# EAGLE design tangnano9k-board (EAGLE 9.0.1)
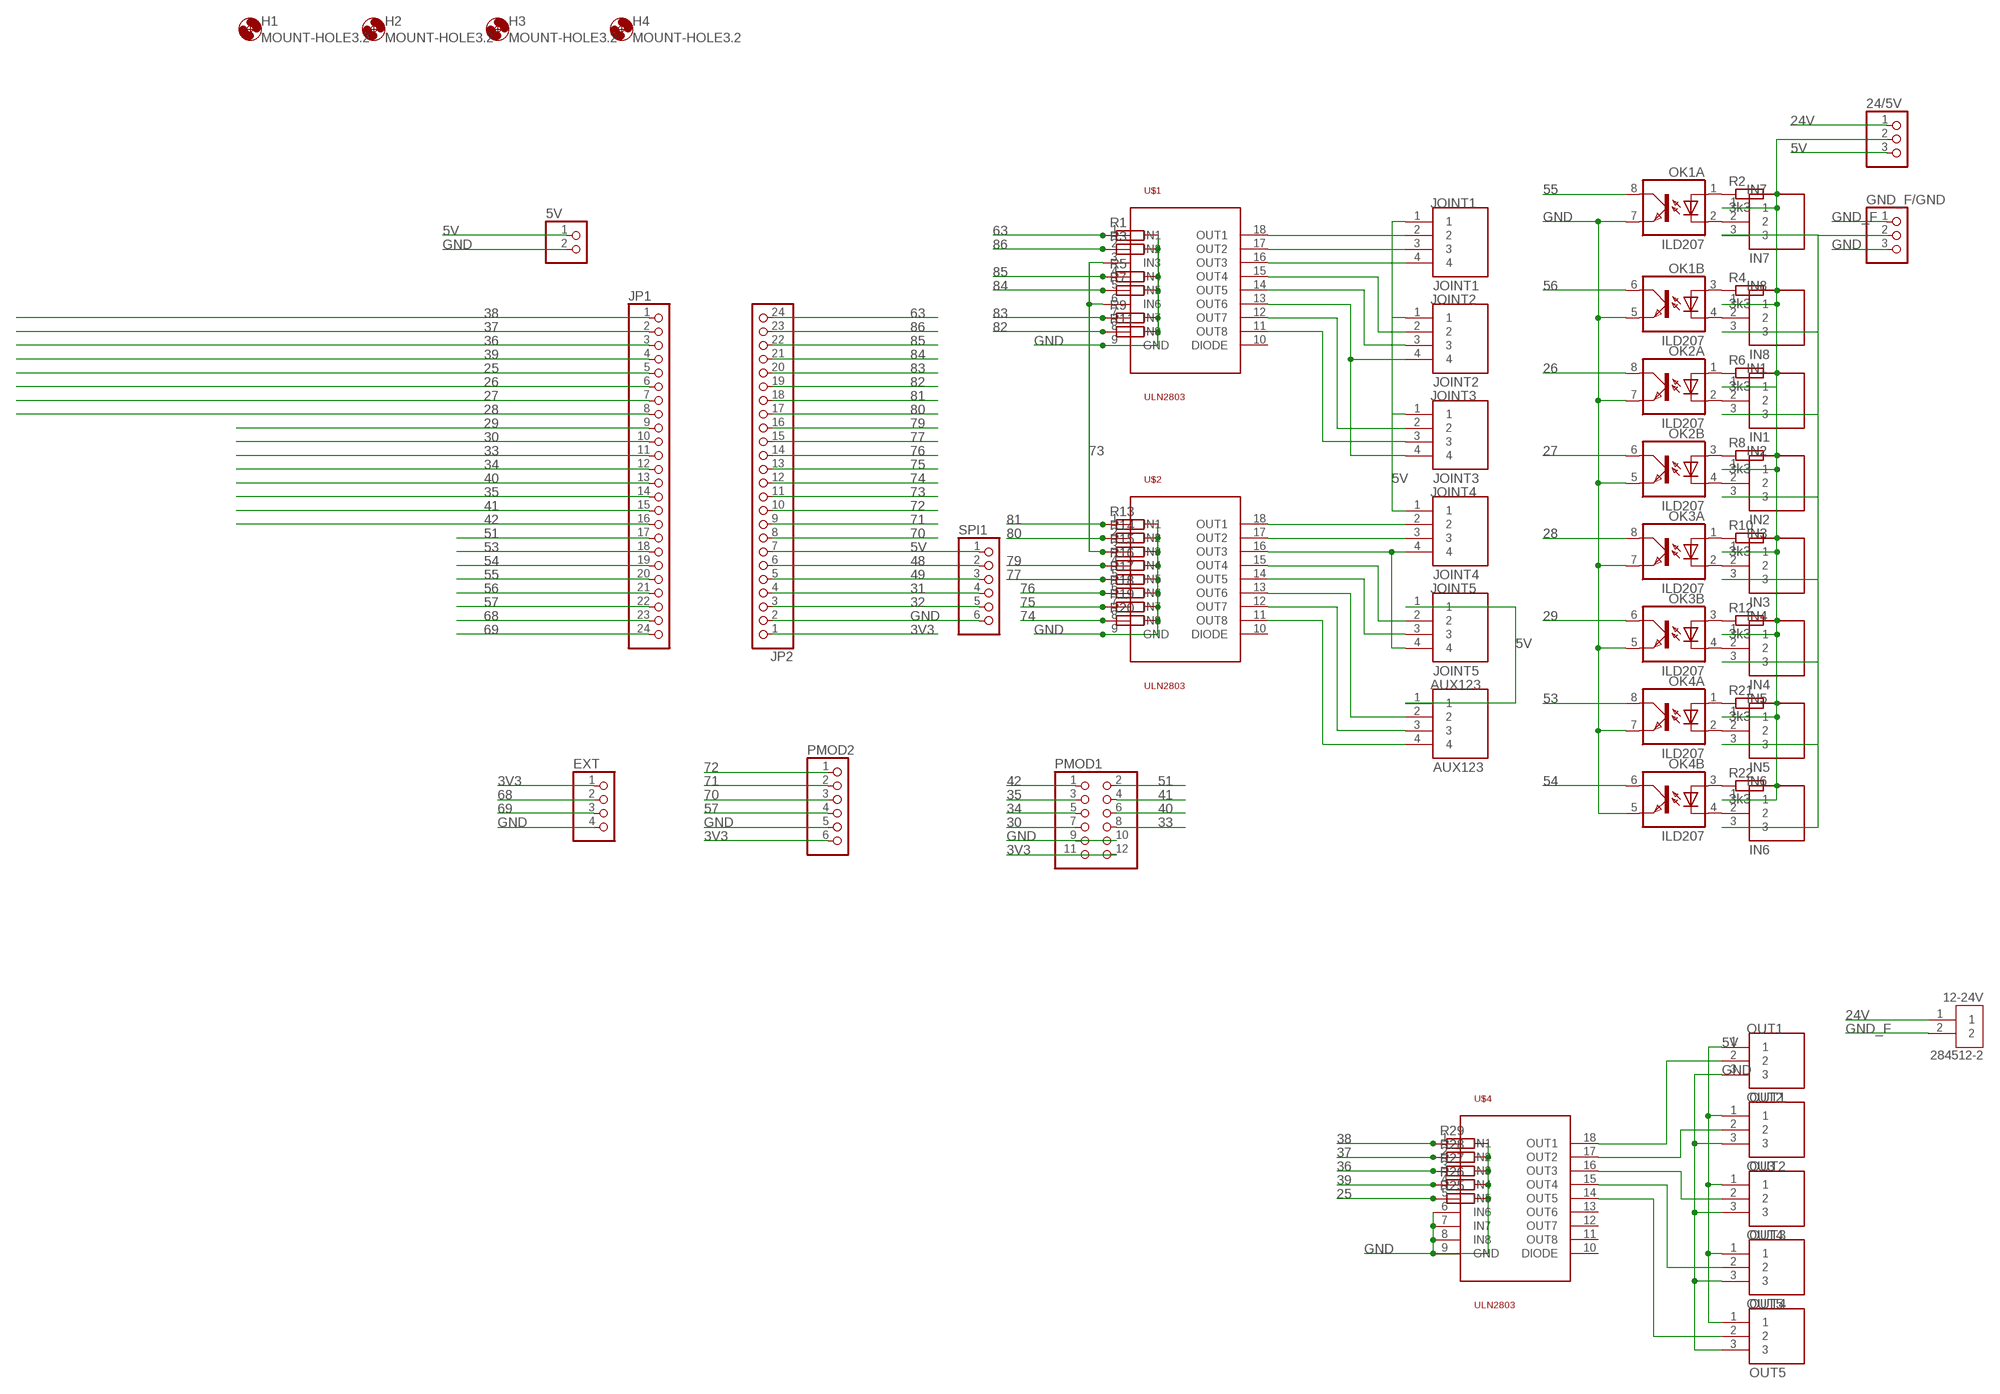
[diagram p0: schematic, sheet 1]

## Parts
5V  PINHD-1X2  [1X02]
12-24V  284512-2  [TE_284512-2]
24/5V  PINHD-1X3  [1X03]
AUX123  AUX123  284512-4  [TE_284512-4]
EXT  PINHD-1X4  [1X04]
GND_F/GND  PINHD-1X3  [1X03]
H1  MOUNT-HOLE3.2  [3,2]
H2  MOUNT-HOLE3.2  [3,2]
H3  MOUNT-HOLE3.2  [3,2]
H4  MOUNT-HOLE3.2  [3,2]
IN1  IN1  284512-3  [TE_284512-3]
IN2  IN2  284512-3  [TE_284512-3]
IN3  IN3  284512-3  [TE_284512-3]
IN4  IN4  284512-3  [TE_284512-3]
IN5  IN5  284512-3  [TE_284512-3]
IN6  IN6  284512-3  [TE_284512-3]
IN7  IN7  284512-3  [TE_284512-3]
IN8  IN8  284512-3  [TE_284512-3]
JOINT1  JOINT1  284512-4  [TE_284512-4]
JOINT2  JOINT2  284512-4  [TE_284512-4]
JOINT3  JOINT3  284512-4  [TE_284512-4]
JOINT4  JOINT4  284512-4  [TE_284512-4]
JOINT5  JOINT5  284512-4  [TE_284512-4]
JP1  PINHD-1X24  [1X24]
JP2  PINHD-1X24  [1X24]
OK1  ILD207  [SOIC08]
OK2  ILD207  [SOIC08]
OK3  ILD207  [SOIC08]
OK4  ILD207  [SOIC08]
OU3  OUT3  284512-3  [TE_284512-3]
OUT1  OUT1  284512-3  [TE_284512-3]
OUT2  OUT2  284512-3  [TE_284512-3]
OUT4  OUT4  284512-3  [TE_284512-3]
OUT5  OUT5  284512-3  [TE_284512-3]
PMOD1  PINHD-2X6  [2X06]
PMOD2  PINHD-1X6  [1X06]
R1  R-EU_M0805  [M0805]
R2  3k3  R-EU_M0805  [M0805]
R3  R-EU_M0805  [M0805]
R4  3k3  R-EU_M0805  [M0805]
R5  R-EU_M0805  [M0805]
R6  3k3  R-EU_M0805  [M0805]
R7  R-EU_M0805  [M0805]
R8  3k3  R-EU_M0805  [M0805]
R9  R-EU_M0805  [M0805]
R10  3k3  R-EU_M0805  [M0805]
R11  R-EU_M0805  [M0805]
R12  3k3  R-EU_M0805  [M0805]
R13  R-EU_M0805  [M0805]
R14  R-EU_M0805  [M0805]
R15  R-EU_M0805  [M0805]
R16  R-EU_M0805  [M0805]
R17  R-EU_M0805  [M0805]
R18  R-EU_M0805  [M0805]
R19  R-EU_M0805  [M0805]
R20  R-EU_M0805  [M0805]
R21  3k3  R-EU_M0805  [M0805]
R22  3k3  R-EU_M0805  [M0805]
R25  R-EU_M0805  [M0805]
R26  R-EU_M0805  [M0805]
R27  R-EU_M0805  [M0805]
R28  R-EU_M0805  [M0805]
R29  R-EU_M0805  [M0805]
SPI1  PINHD-1X6  [1X06]
U$1  ULN2803  [SO18L]
U$2  ULN2803  [SO18L]
U$4  ULN2803  [SO18L]

## Nets
3V3: EXT.1 JP2.1 PMOD1.11 PMOD1.12 PMOD2.6
5V: 5V.1 24/5V.3 AUX123.1 JOINT1.1 JOINT2.1 JOINT3.1 JOINT4.1 JOINT5.1 JP2.7 OU3.1 OUT1.1 OUT2.1 OUT4.1 OUT5.1 SPI1.1
24V: 12-24V.1 24/5V.1
25: JP1.5 R25.1 U$4.5(IN5)
26: JP1.6 OK2.8(A:COL)
27: JP1.7 OK2.6(B:COL)
28: JP1.8 OK3.8(A:COL)
29: JP1.9 OK3.6(B:COL)
30: JP1.10 PMOD1.7
31: JP2.4 SPI1.4
32: JP2.3 SPI1.5
33: JP1.11 PMOD1.8
34: JP1.12 PMOD1.5
35: JP1.14 PMOD1.3
36: JP1.3 R27.1 U$4.3(IN3)
37: JP1.2 R28.1 U$4.2(IN2)
38: JP1.1 R29.1 U$4.1(IN1)
39: JP1.4 R26.1 U$4.4(IN4)
40: JP1.13 PMOD1.6
41: JP1.15 PMOD1.4
42: JP1.16 PMOD1.1
48: JP2.6 SPI1.2
49: JP2.5 SPI1.3
51: JP1.17 PMOD1.2
53: JP1.18 OK4.8(A:COL)
54: JP1.19 OK4.6(B:COL)
55: JP1.20 OK1.8(A:COL)
56: JP1.21 OK1.6(B:COL)
57: JP1.22 PMOD2.4
63: JP2.24 R1.1 U$1.1(IN1)
68: EXT.2 JP1.23
69: EXT.3 JP1.24
70: JP2.8 PMOD2.3
71: JP2.9 PMOD2.2
72: JP2.10 PMOD2.1
73: JP2.11 R15.1 U$1.3(IN3) U$1.6(IN6) U$2.3(IN3)
74: JP2.12 R20.1 U$2.8(IN8)
75: JP2.13 R19.1 U$2.7(IN7)
76: JP2.14 R18.1 U$2.6(IN6)
77: JP2.15 R17.1 U$2.5(IN5)
79: JP2.16 R16.1 U$2.4(IN4)
80: JP2.17 R14.1 U$2.2(IN2)
81: JP2.18 R13.1 U$2.1(IN1)
82: JP2.19 R11.1 U$1.8(IN8)
83: JP2.20 R9.1 U$1.7(IN7)
84: JP2.21 R7.1 U$1.5(IN5)
85: JP2.22 R5.1 U$1.4(IN4)
86: JP2.23 R3.1 U$1.2(IN2)
GND: 5V.2 EXT.4 GND_F/GND.3 JP2.2 OK1.5(B:EMIT) OK1.7(A:EMIT) OK2.5(B:EMIT) OK2.7(A:EMIT) OK3.5(B:EMIT) OK3.7(A:EMIT) OK4.5(B:EMIT) OK4.7(A:EMIT) OU3.3 OUT1.3 OUT2.3 OUT4.3 OUT5.3 PMOD1.9 PMOD1.10 PMOD2.5 R1.2 R3.2 R5.2 R7.2 R9.2 R11.2 R13.2 R14.2 R15.2 R16.2 R17.2 R18.2 R19.2 R20.2 R25.2 R26.2 R27.2 R28.2 R29.2 SPI1.6 U$1.9(GND) U$2.9(GND) U$4.6(IN6) U$4.7(IN7) U$4.8(IN8) U$4.9(GND)
GND_F: 12-24V.2 GND_F/GND.1
N$1: JOINT1.4 U$1.16(OUT3)
N$2: JOINT1.3 U$1.17(OUT2)
N$3: JOINT1.2 U$1.18(OUT1)
N$4: JOINT2.2 U$1.15(OUT4)
N$5: JOINT2.3 U$1.14(OUT5)
N$6: JOINT2.4 JOINT3.4 U$1.13(OUT6)
N$7: JOINT3.2 U$1.12(OUT7)
N$8: JOINT3.3 U$1.11(OUT8)
N$9: JOINT4.2 U$2.18(OUT1)
N$10: JOINT4.3 U$2.17(OUT2)
N$11: JOINT4.4 JOINT5.4 U$2.16(OUT3)
N$12: JOINT5.2 U$2.15(OUT4)
N$13: JOINT5.3 U$2.14(OUT5)
N$14: AUX123.2 U$2.13(OUT6)
N$15: AUX123.3 U$2.12(OUT7)
N$16: AUX123.4 U$2.11(OUT8)
N$17: IN7.2 OK1.2(A:C)
N$18: IN8.2 OK1.4(B:C)
N$19: IN1.2 OK2.2(A:C)
N$20: IN2.2 OK2.4(B:C)
N$21: IN3.2 OK3.2(A:C)
N$22: IN4.2 OK3.4(B:C)
N$23: IN5.2 OK4.2(A:C)
N$24: IN6.2 OK4.4(B:C)
N$27: OK1.1(A:A) R2.1
N$28: OK1.3(B:A) R4.1
N$29: OK2.1(A:A) R6.1
N$30: OK2.3(B:A) R8.1
N$31: OK3.1(A:A) R10.1
N$32: OK3.3(B:A) R12.1
N$33: OK4.1(A:A) R21.1
N$34: OK4.3(B:A) R22.1
N$37: OUT2.2 U$4.17(OUT2)
N$38: OU3.2 U$4.16(OUT3)
N$39: OUT4.2 U$4.15(OUT4)
N$40: OUT5.2 U$4.14(OUT5)
N$41: OUT1.2 U$4.18(OUT1)
N$42: 24/5V.2 IN1.1 IN2.1 IN3.1 IN4.1 IN5.1 IN6.1 IN7.1 IN8.1 R2.2 R4.2 R6.2 R8.2 R10.2 R12.2 R21.2 R22.2
N$44: GND_F/GND.2 IN1.3 IN2.3 IN3.3 IN4.3 IN5.3 IN6.3 IN7.3 IN8.3
Unconnected: U$1.10(DIODE) U$2.10(DIODE) U$4.10(DIODE) U$4.11(OUT8) U$4.12(OUT7) U$4.13(OUT6)

## Library data of the parts
5V = pinhead:PINHD-1X2: PIN HEADER
12-24V = 284512-2:284512-2: Terminal Block Header, 2, 300 V, 11 A, 3.5 Mm, Through Hole Right Angle, Header Check availability <https://pricing.snapeda.com/parts/284512-2/TE%20Connectivity/view-part?ref=eda>; AVAILABILITY: In Stock; COMMENT: 284512-2; DESCRIPTION: 2 Position Terminal Block Header, Male Pins, Shrouded (4 Side) 0.138 (3.50mm) 90°, Right Angle Through Hole; EU_ROHS_COMPLIANCE: Compliant; MF: TE Connectivity; MP: 284512-2; PACKAGE: None; PRICE: None; PURCHASE-URL: https://pricing.snapeda.com/search?q=284512-2&ref=eda
24/5V GND_F/GND = pinhead:PINHD-1X3: PIN HEADER
AUX123 JOINT1-JOINT5 = 284512-4:284512-4: Check availability <https://pricing.snapeda.com/parts/284512-4/TE%20Connectivity/view-part?ref=eda>; AVAILABILITY: In Stock; CENTERLINE_PITCH: 3.5 mm[.138 in]; COMMENT: 284512-4; DESCRIPTION: 4 POS TERMI-BLOK HDR 900 POLAR; EU_ROHS_COMPLIANCE: Compliant; MF: TE Connectivity; MP: 284512-4; NUMBER_OF_POSITIONS: 4; PACKAGE: None; PRICE: None; PURCHASE-URL: https://pricing.snapeda.com/search/part/284512-4/?ref=eda
EXT = pinhead:PINHD-1X4: PIN HEADER
H1-H4 = holes:MOUNT-HOLE: MOUNTING HOLE with drill center marker
IN1-IN8 OU3 OUT1 OUT2 OUT4 OUT5 = 284512-3:284512-3: Check availability <https://pricing.snapeda.com/parts/284512-3/TE%20Connectivity/view-part?ref=eda>; AVAILABILITY: In Stock; CENTERLINE_PITCH: 3.5 mm[.138 in]; COMMENT: 284512-3; DESCRIPTION: Pluggable terminal block; socket; male; angled; 3.5mm;; EU_ROHS_COMPLIANCE: Compliant; MF: TE Connectivity; MP: 284512-3; NUMBER_OF_POSITIONS: 3; PACKAGE: None; PRICE: None; PURCHASE-URL: https://pricing.snapeda.com/search/part/284512-3/?ref=eda
JP1 JP2 = pinhead:PINHD-1X24: PIN HEADER
OK1-OK4 = optocoupler:ILD2*: Siemens ILD205/206/207/211/213/217 DUAL PHOTOTRANSISTOR SMALL OUTLINE SURFACE MOUNT OPTOCOUPLER Source: 153385-da-01-en-Optocoupler_ILD205-T.pdf; MF: VISHAY/TELEFUNKEN; MPN: ILD207T; OC_FARNELL: 1469603; OC_NEWARK: 97C8648
PMOD1 = pinhead:PINHD-2X6: PIN HEADER
PMOD2 SPI1 = pinhead:PINHD-1X6: PIN HEADER
R1-R22 R25-R29 = rcl:R-EU_: RESISTOR, European symbol; SPICEPREFIX: R
U$1 U$2 U$4 = uln2803:ULN2803

## Board
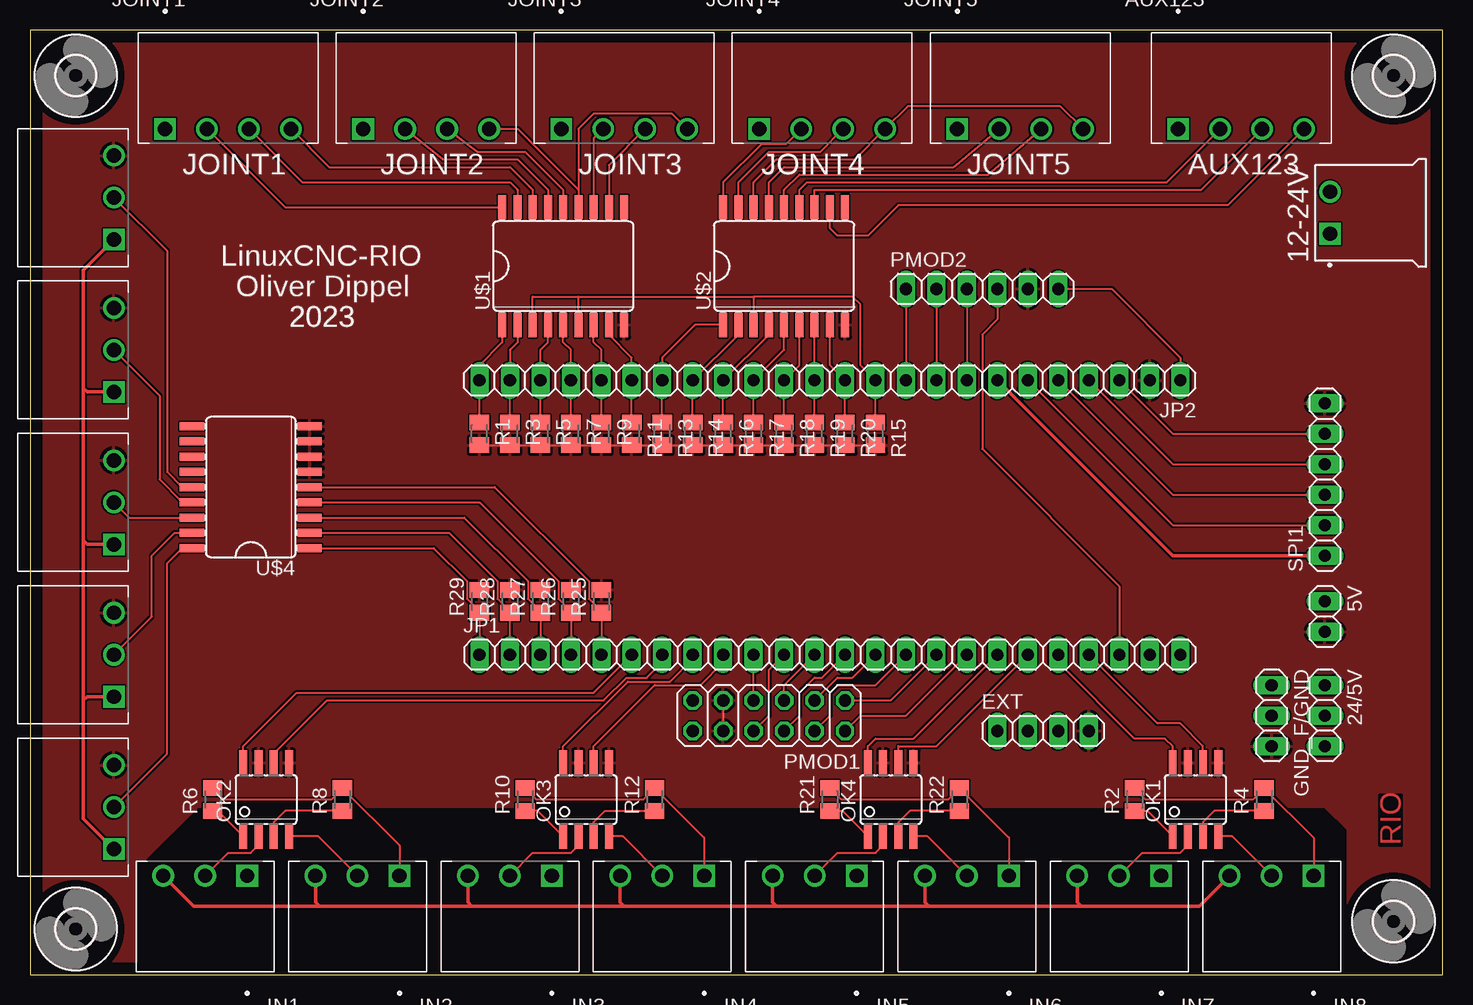
[diagram p1: board, top side]
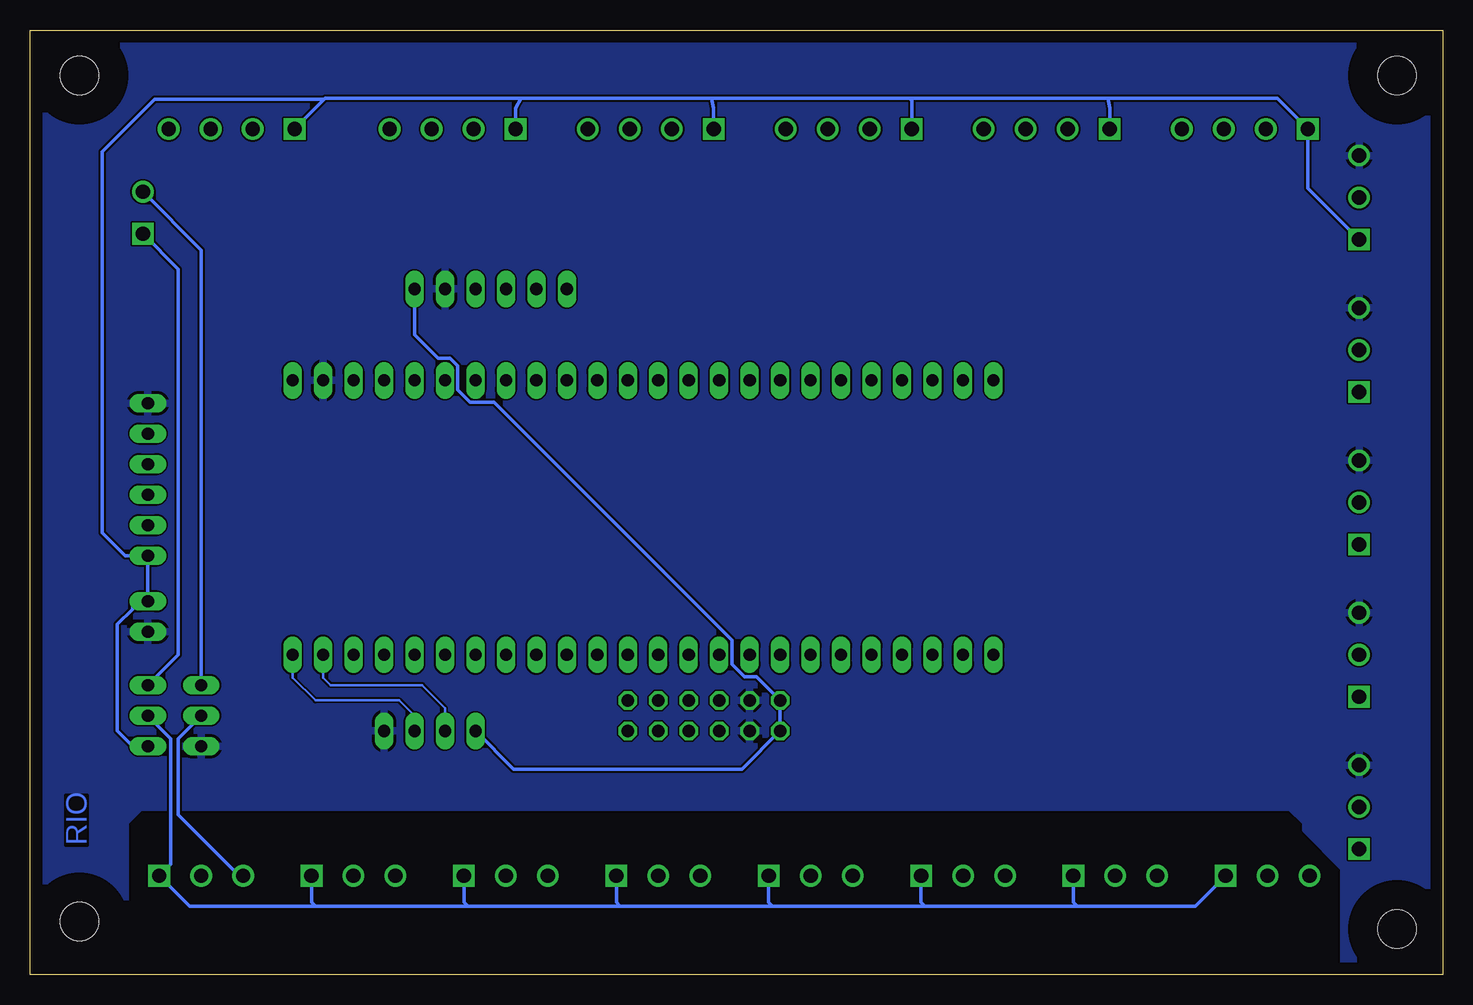
[diagram p2: board, bottom side, seen from below]

Size 117.78 x 78.73 mm. Coordinates in mm from the lower left corner, seen from the top.
Outline: 0,0 117.78,0 117.78,78.73 0,78.73 0,0
Copper layers (1*16): Top 0.035mm / dielectric 1.5mm / Bottom 0.035mm
Design rules "default": minimum track width 6mil, minimum drill 0.35mm, track to track 6mil, track to pad 6mil, pad to pad 6mil, via to via 6mil, smd to smd 6mil, copper to edge 40mil, drill to drill 6mil, minimum pad ring 10mil, minimum via ring 8mil, stop-mask expansion 4mil, vias tented up to drill 0mil, thermal gap 10mil

### Footprints (pad centres in the part's own frame; a part is rotated, then mirrored left to right if it is on the bottom)
1X02 = drill 1.016 long: 1 -1.27,0; 2 1.27,0
TE_284512-2 = drill 1.2 square: 1 -1.75,3.4 | drill 1.2: 2 1.75,3.4
1X03 = drill 1.016 long: 1 -2.54,0; 2 0,0; 3 2.54,0
TE_284512-4 = drill 1.2 square: 1 -5.25,0 | drill 1.2: 2 -1.75,0; 3 1.75,0; 4 5.25,0
1X04 = drill 1.016 long: 1 -3.81,0; 2 -1.27,0; 3 1.27,0; 4 3.81,0
3,2 = hole 3.2: 0,0
TE_284512-3 = drill 1.2 square: 1 -3.5,0 | drill 1.2: 2 0,0; 3 3.5,0
1X24 = drill 1.016 long: 1 -29.21,0; 2 -26.67,0; 3 -24.13,0; 4 -21.59,0; 5 -19.05,0; 6 -16.51,0; 7 -13.97,0; 8 -11.43,0; 9 -8.89,0; 10 -6.35,0; 11 -3.81,0; 12 -1.27,0; 13 1.27,0; 14 3.81,0; 15 6.35,0; 16 8.89,0; 17 11.43,0; 18 13.97,0; 19 16.51,0; 20 19.05,0; 21 21.59,0; 22 24.13,0; 23 26.67,0; 24 29.21,0
SOIC08 = smd 0.66 x 2.032: 1 -1.905,-3.073; 2 -0.635,-3.073; 3 0.635,-3.073; 4 1.905,-3.073; 5 1.905,3.073; 6 0.635,3.073; 7 -0.635,3.073; 8 -1.905,3.073
2X06 = drill 1.016 octagon: 1 -6.35,-1.27; 2 -6.35,1.27; 3 -3.81,-1.27; 4 -3.81,1.27; 5 -1.27,-1.27; 6 -1.27,1.27; 7 1.27,-1.27; 8 1.27,1.27; 9 3.81,-1.27; 10 3.81,1.27; 11 6.35,-1.27; 12 6.35,1.27
1X06 = drill 1.016 long: 1 -6.35,0; 2 -3.81,0; 3 -1.27,0; 4 1.27,0; 5 3.81,0; 6 6.35,0
M0805 = smd 1.3 x 1.6: 1 -0.95,0; 2 0.95,0
SO18L = smd 0.66 x 2.032: 1 -5.08,-4.902; 2 -3.81,-4.902; 3 -2.54,-4.902; 4 -1.27,-4.902; 5 0,-4.902; 6 1.27,-4.902; 7 2.54,-4.902; 8 3.81,-4.902; 9 5.08,-4.902; 10 5.08,4.902; 11 3.81,4.902; 12 2.54,4.902; 13 1.27,4.902; 14 0,4.902; 15 -1.27,4.902; 16 -2.54,4.902; 17 -3.81,4.902; 18 -5.08,4.902

### Placement (x,y rotation side)
5V  107.95,29.85 270 top
12-24V  111.76,63.5 90 top
24/5V  107.95,21.59 270 top
AUX123  100.97,70.48 0 top
EXT  84.45,20.32 0 top
GND_F/GND  103.51,21.59 270 top
H1  3.81,74.93 0 top
H2  113.67,74.93 0 top
H3  3.81,3.81 0 top
H4  113.67,4.45 0 top
IN1  14.6,8.25 180 top
IN2  27.3,8.25 180 top
IN3  40,8.25 180 top
IN4  52.7,8.25 180 top
IN5  65.41,8.25 180 top
IN6  78.11,8.25 180 top
IN7  90.81,8.25 180 top
IN8  103.51,8.25 180 top
JOINT1  16.51,70.48 0 top
JOINT2  33.02,70.48 0 top
JOINT3  49.53,70.48 0 top
JOINT4  66.04,70.48 0 top
JOINT5  82.55,70.48 0 top
JP1  66.68,26.67 0 top
JP2  66.68,49.53 180 top
OK1  97.16,14.6 0 top
OK2  19.69,14.6 0 top
OK3  46.35,14.6 0 top
OK4  71.76,14.6 0 top
OU3  6.98,39.37 90 top
OUT1  6.98,13.97 90 top
OUT2  6.98,26.67 90 top
OUT4  6.98,52.07 90 top
OUT5  6.98,64.77 90 top
PMOD1  61.59,21.59 180 top
PMOD2  79.38,57.15 0 top
R1  37.46,45.09 270 top
R2  92.08,14.6 90 top
R3  40,45.09 270 top
R4  102.87,14.6 90 top
R5  42.54,45.09 270 top
R6  15.24,14.6 90 top
R7  45.09,45.09 270 top
R8  26.03,14.6 90 top
R9  47.62,45.09 270 top
R10  41.27,14.6 90 top
R11  50.16,45.09 270 top
R12  52.07,14.6 90 top
R13  52.7,45.09 270 top
R14  55.24,45.09 270 top
R15  70.48,45.09 270 top
R16  57.79,45.09 270 top
R17  60.32,45.09 270 top
R18  62.87,45.09 270 top
R19  65.41,45.09 270 top
R20  67.95,45.09 270 top
R21  66.68,14.6 90 top
R22  77.47,14.6 90 top
R25  47.62,31.12 90 top
R26  45.09,31.12 90 top
R27  42.54,31.12 90 top
R28  40,31.12 90 top
R29  37.46,31.12 90 top
SPI1  107.95,41.27 90 top
U$1  44.45,59.05 0 top
U$2  62.87,59.05 0 top
U$4  18.41,40.64 90 top

### Tracks (layer width: path | path; a pad name or v marks a point on that pad's centre or on a via)
3V3
  Top 0.152: JP2.1 95.89,51.44 90.17,57.15 PMOD2.6
  Bottom 0.305: PMOD2.6 85.73,53.34 83.74,51.36 82.74,51.36 82.12,50.73 82.12,48.73 81.09,47.7 79.09,47.7 59.26,27.87 59.26,25.87 58.23,24.84 57.23,24.84 PMOD1.11 PMOD1.12 58.42,17.14 77.47,17.14 EXT.1
5V
  Top 0.305: SPI1.1 95.25,34.93 JP2.7 | OUT5.1 4.44,58.73 4.44,48.9 | OUT1.1 4.44,13.01 4.44,22.86 | 4.44,48.9 4.44,36.2 | 4.44,36.2 4.44,22.86 | OUT4.1 4.77,48.57 4.44,48.9 | OU3.1 4.77,35.87 4.44,36.2 | OUT2.1 4.75,23.17 4.44,22.86
  Bottom 0.305: AUX123.1 93.26,72.94 | 93.26,72.94 93.18,73.03 76.84,73.03 | 76.84,73.03 60.96,73.03 | 60.96,73.03 44.45,73.03 | 44.45,73.03 27.94,73.03 | 27.94,73.03 13.8,73.03 JOINT1.1 11.26,65.55 OUT5.1 | JOINT2.1 27.77,72.22 27.94,73.03 | JOINT3.1 44.28,72.86 44.45,73.03 | JOINT4.1 60.79,72.22 60.96,73.03 | JOINT5.1 77.3,72.22 76.84,73.03 | 24/5V.3 109.22,19.05 110.49,20.32 110.49,29.21 109.22,30.48 109.22,31.12 5V.1 SPI1.1 109.86,34.93 111.76,36.83 111.76,68.58 107.4,72.94 93.26,72.94
24V
  Bottom 0.305: 24/5V.1 105.41,26.67 105.41,58.8 12-24V.1
25
  Top 0.152: JP1.5 R25.1 47.62,30.29 46.6,31.32 46.6,32.78 38.73,40.64 U$4.5
26
  Top 0.152: 50.8,26.67 JP1.6 46.99,23.5 22.23,23.5 17.78,19.05 OK2.8
27
  Top 0.152: OK2.6 20.32,18.42 24.77,22.86 47.83,22.86 49.71,24.74 51.41,24.74 52.7,26.04 JP1.7
28
  Top 0.152: OK3.8 44.45,19.05 49.84,24.44 53.34,24.44 55.24,26.34 JP1.8
29
  Top 0.152: OK3.6 46.99,19.05 52.07,24.13 55.88,24.13 57.79,26.04 JP1.9
30
  Top 0.152: 60.32,26.04 JP1.10 PMOD1.7
31
  Top 0.152: JP2.4 95.25,42.55 SPI1.4
32
  Top 0.152: JP2.3 95.25,45.09 SPI1.5
33
  Top 0.152: PMOD1.8 61.59,21.59 61.59,25.4 JP1.11
34
  Top 0.152: 65.41,26.04 JP1.12 62.87,24.13 PMOD1.5
35
  Top 0.152: PMOD1.3 67.31,24.77 68.58,24.77 JP1.14
36
  Top 0.152: U$4.3 36.2,38.1 41.52,32.78 41.52,31.32 42.54,30.29 R27.1 JP1.3
37
  Top 0.152: JP1.2 40,29.85 R28.1 40,30.29 38.98,31.32 38.98,32.78 34.92,36.83 U$4.2
38
  Top 0.152: U$4.1 33.65,35.56 36.44,32.78 36.44,31.32 37.46,30.29 R29.1 JP1.1
39
  Top 0.152: JP1.4 45.09,30.29 44.99,30.39 | 44.99,30.39 44.06,31.32 44.06,32.78 37.46,39.37 U$4.4 | R26.1 44.99,30.26 44.99,30.39
40
  Top 0.152: PMOD1.6 64.14,21.59 64.14,23.5 65.41,24.77 66.04,24.77 JP1.13
41
  Top 0.152: PMOD1.4 66.68,21.59 66.68,23.5 67.31,24.13 70.48,24.13 JP1.15
42
  Top 0.152: PMOD1.1 71.76,22.86 JP1.16
48
  Top 0.152: JP2.6 95.25,37.47 SPI1.2
49
  Top 0.152: JP2.5 95.25,40.01 SPI1.3
51
  Top 0.152: PMOD1.2 69.22,21.59 73.03,21.59 JP1.17
53
  Top 0.152: OK4.8 69.85,19.05 70.48,19.69 73.66,19.69 JP1.18
54
  Top 0.152: OK4.6 72.39,19.05 75.56,19.05 JP1.19
55
  Top 0.152: OK1.8 95.25,19.05 94.62,19.69 92.08,19.69 85.73,26.04 JP1.20
56
  Top 0.152: OK1.6 97.79,19.05 95.89,20.96 93.98,20.96 JP1.21
57
  Top 0.152: PMOD2.4 80.65,54.61 79.38,53.34 79.38,43.81 90.81,32.38 JP1.22
63
  Top 0.152: R1.1 37.46,48.9 JP2.24 37.46,50.8 39.37,52.7 U$1.1
68
  Bottom 0.203: EXT.2 83.19,22.23 85.09,24.13 92.71,24.13 93.34,24.77 JP1.23
69
  Bottom 0.203: EXT.3 85.73,21.59 87,22.86 93.98,22.86 95.89,24.77 JP1.24
70
  Top 0.152: PMOD2.3 JP2.8
71
  Top 0.152: PMOD2.2 JP2.9
72
  Top 0.152: PMOD2.1 JP2.10
73
  Top 0.152: R15.1 JP2.11 69.22,50.8 69.22,55.88 68.58,56.52 60.32,56.52 | U$1.3 41.91,56.52 45.72,56.52 | 45.72,56.52 60.32,56.52 | 60.32,56.52 U$2.3 | U$1.6 45.72,56.52
74
  Top 0.152: R20.1 JP2.12 66.68,50.8 U$2.8
75
  Top 0.152: R19.1 JP2.13 U$2.7
76
  Top 0.152: R18.1 JP2.14 64.14,50.8 U$2.6
77
  Top 0.152: R17.1 JP2.15 62.87,52.07 U$2.5
79
  Top 0.152: R16.1 JP2.16 61.59,53.34 U$2.4
80
  Top 0.152: R14.1 JP2.17 59.05,53.34 U$2.2
81
  Top 0.152: R13.1 JP2.18 52.7,51.44 55.42,54.15 U$2.1
82
  Top 0.152: R11.1 JP2.19 50.16,51.44 48.26,53.34 U$1.8
83
  Top 0.152: R9.1 JP2.20 47.62,52.07 46.99,52.7 U$1.7
84
  Top 0.152: R7.1 JP2.21 45.09,52.07 44.45,52.7 U$1.5
85
  Top 0.152: R5.1 JP2.22 42.54,52.07 43.18,52.7 U$1.4
86
  Top 0.152: R3.1 JP2.23 40,52.07 40.64,52.7 U$1.2
GND
  Top 0.152: R1.2 R15.2 | PMOD1.9 PMOD1.10
  pour Bottom: -6.35,81.92 -6.35,-3.17 7.62,-3.17 8.26,-2.54 8.26,8.89 11.43,12.06 11.43,12.7 12.7,13.97 108.59,13.97 109.86,12.7 109.86,-3.17 110.49,-3.81 123.83,-3.81 123.83,81.92
  pour Top: -7.62,85.09 128.27,86.36 128.27,-5.71 109.22,-6.35 109.86,-5.71 109.86,12.06 107.95,13.97 13.97,13.97 9.53,9.53 8.89,9.53 8.89,-1.91 3.81,-6.99 -7.62,-6.99
GND_F
  Bottom 0.305: 108.2,65.41 12-24V.2 103.51,60.4 GND_F/GND.1
N$1
  Top 0.152: JOINT1.4 24.93,67.31 40,67.31 41.91,65.41 U$1.16
N$2
  Top 0.152: JOINT1.3 22.7,66.04 40,66.04 40.64,65.41 U$1.17
N$3
  Top 0.152: JOINT1.2 21.29,63.96 U$1.18
N$4
  Top 0.152: JOINT2.2 34.45,67.95 40.64,67.95 43.18,65.41 U$1.15
N$5
  Top 0.152: JOINT2.3 37.31,68.58 41.27,68.58 44.45,65.41 U$1.14
N$6
  Top 0.152: JOINT2.4 40.64,70.48 45.72,65.41 | 45.72,65.41 U$1.13 | JOINT3.4 53.51,71.75 46.99,71.75 45.72,70.48 45.72,65.41
N$7
  Top 0.152: JOINT3.2 46.99,69.7 U$1.12
N$8
  Top 0.152: JOINT3.3 48.26,67.47 U$1.11
N$9
  Top 0.152: JOINT4.2 63.02,69.22 60.96,69.22 57.79,66.04 U$2.18
N$10
  Top 0.152: U$2.17 59.05,66.04 61.59,68.58 65.89,68.58 JOINT4.3
N$11
  Top 0.152: U$2.16 60.32,66.04 62.23,67.95 68.75,67.95 71.2,70.4 JOINT4.4 73.2,72.39 85.9,72.39 JOINT5.4
N$12
  Top 0.152: U$2.15 61.59,66.04 62.87,67.31 76.99,67.31 JOINT5.2
N$13
  Top 0.152: U$2.14 62.87,65.41 64.14,66.67 79.86,66.67 JOINT5.3
N$14
  Top 0.152: U$2.13 64.14,65.41 64.77,66.04 94.77,66.04 AUX123.2
N$15
  Top 0.152: U$2.12 65.41,65.41 97.64,65.41 AUX123.3
N$16
  Top 0.152: AUX123.4 99.87,64.13 72.39,64.13 69.85,61.59 67.31,61.59 66.68,62.23 U$2.11
N$17
  Top 0.152: IN7.2 92.71,10.16 95.89,10.16 96.52,10.79 OK1.2
N$18
  Top 0.152: IN8.2 100.23,11.53 OK1.4
N$19
  Top 0.152: IN1.2 16.51,10.16 18.41,10.16 19.05,10.79 OK2.2
N$20
  Top 0.152: IN2.2 24.03,11.53 OK2.4
N$21
  Top 0.152: IN3.2 41.91,10.16 45.09,10.16 45.72,10.79 OK3.2
N$22
  Top 0.152: IN4.2 49.43,11.53 OK3.4
N$23
  Top 0.152: IN5.2 67.31,10.16 70.48,10.16 71.12,10.79 OK4.2
N$24
  Top 0.152: IN6.2 74.83,11.53 OK4.4
N$27
  Top 0.152: R2.1 93.13,13.65 OK1.1
N$28
  Top 0.152: R4.1 98.75,13.65 97.79,12.7 OK1.3
N$29
  Top 0.152: R6.1 15.66,13.65 OK2.1
N$30
  Top 0.152: R8.1 21.27,13.65 20.32,12.7 OK2.3
N$31
  Top 0.152: OK3.1 42.33,13.65 R10.1
N$32
  Top 0.152: OK3.3 46.99,12.7 47.95,13.65 R12.1
N$33
  Top 0.152: R21.1 67.73,13.65 OK4.1
N$34
  Top 0.152: R22.1 73.34,13.65 72.39,12.7 OK4.3
N$37
  Top 0.152: OUT2.2 10.16,29.85 10.16,34.93 12.06,36.83 U$4.17
N$38
  Top 0.152: OU3.2 8.26,38.1 U$4.16
N$39
  Top 0.152: OUT4.2 10.79,48.26 10.79,41.27 12.7,39.37
  Top 0.305: U$4.15 12.7,39.37
N$40
  Top 0.152: OUT5.2 11.43,60.33 11.43,41.91 12.7,40.64 U$4.14
N$41
  Top 0.152: OUT1.2 11.43,18.42 11.43,34.29 12.7,35.56 U$4.18
N$42
  Top 0.152: R6.2 16.19,14.6 25.09,14.6 R8.2 30.8,10.79 IN2.1 | R10.2 42.22,14.6 51.12,14.6 R12.2 56.2,11.42 IN4.1 | R21.2 67.62,14.6 76.52,14.6 R22.2 81.61,11.42 IN6.1 | R2.2 93.03,14.6 101.92,14.6 R4.2 107.01,11.42 IN8.1
  Bottom 0.305: IN1.1 20.64,5.71 30.48,5.71 | 30.48,5.71 43.18,5.71 | 43.18,5.71 55.88,5.71 | 55.88,5.71 68.58,5.71 | 68.58,5.71 81.28,5.71 | 81.28,5.71 93.98,5.71 | 93.98,5.71 104.47,5.71 IN8.1 106.05,9.21 106.05,19.69 24/5V.2 | IN7.1 94.31,6.04 93.98,5.71 | IN6.1 81.61,6.04 81.28,5.71 | IN5.1 68.91,6.04 68.58,5.71 | IN4.1 56.2,6.04 55.88,5.71 | IN3.1 43.5,6.04 43.18,5.71 | IN2.1 30.8,6.04 30.48,5.71
N$44
  Top 0.305: IN1.3 13.64,5.71 24.13,5.71 | IN8.3 97.47,5.71 87.63,5.71 | 24.13,5.71 36.83,5.71 | 36.83,5.71 49.53,5.71 | 49.53,5.71 62.23,5.71 | 62.23,5.71 74.93,5.71 | 74.93,5.71 87.63,5.71 | IN7.3 87.31,6.04 87.63,5.71 | IN6.3 74.61,6.04 74.93,5.71 | IN5.3 61.9,6.04 62.23,5.71 | IN4.3 49.2,6.04 49.53,5.71 | IN3.3 36.5,6.04 36.83,5.71 | IN2.3 23.8,6.04 24.13,5.71
  Bottom 0.305: GND_F/GND.2 105.41,19.69 105.41,13.33 100.33,8.25 IN8.3

### Text on the board
Top: RIO
Bottom: RIO
tNames: JOINT1 | JOINT2 | JOINT3 | JOINT4 | JOINT4 | JOINT5 | AUX123 | LinuxCNC-RIO | Oliver Dippel | 2023 | 2023